# Altium schematic sheet PWR.SchDoc
size 320 x 228 mm; DocumentNumber: 4; SheetNumber: 4; SheetTotal: 5
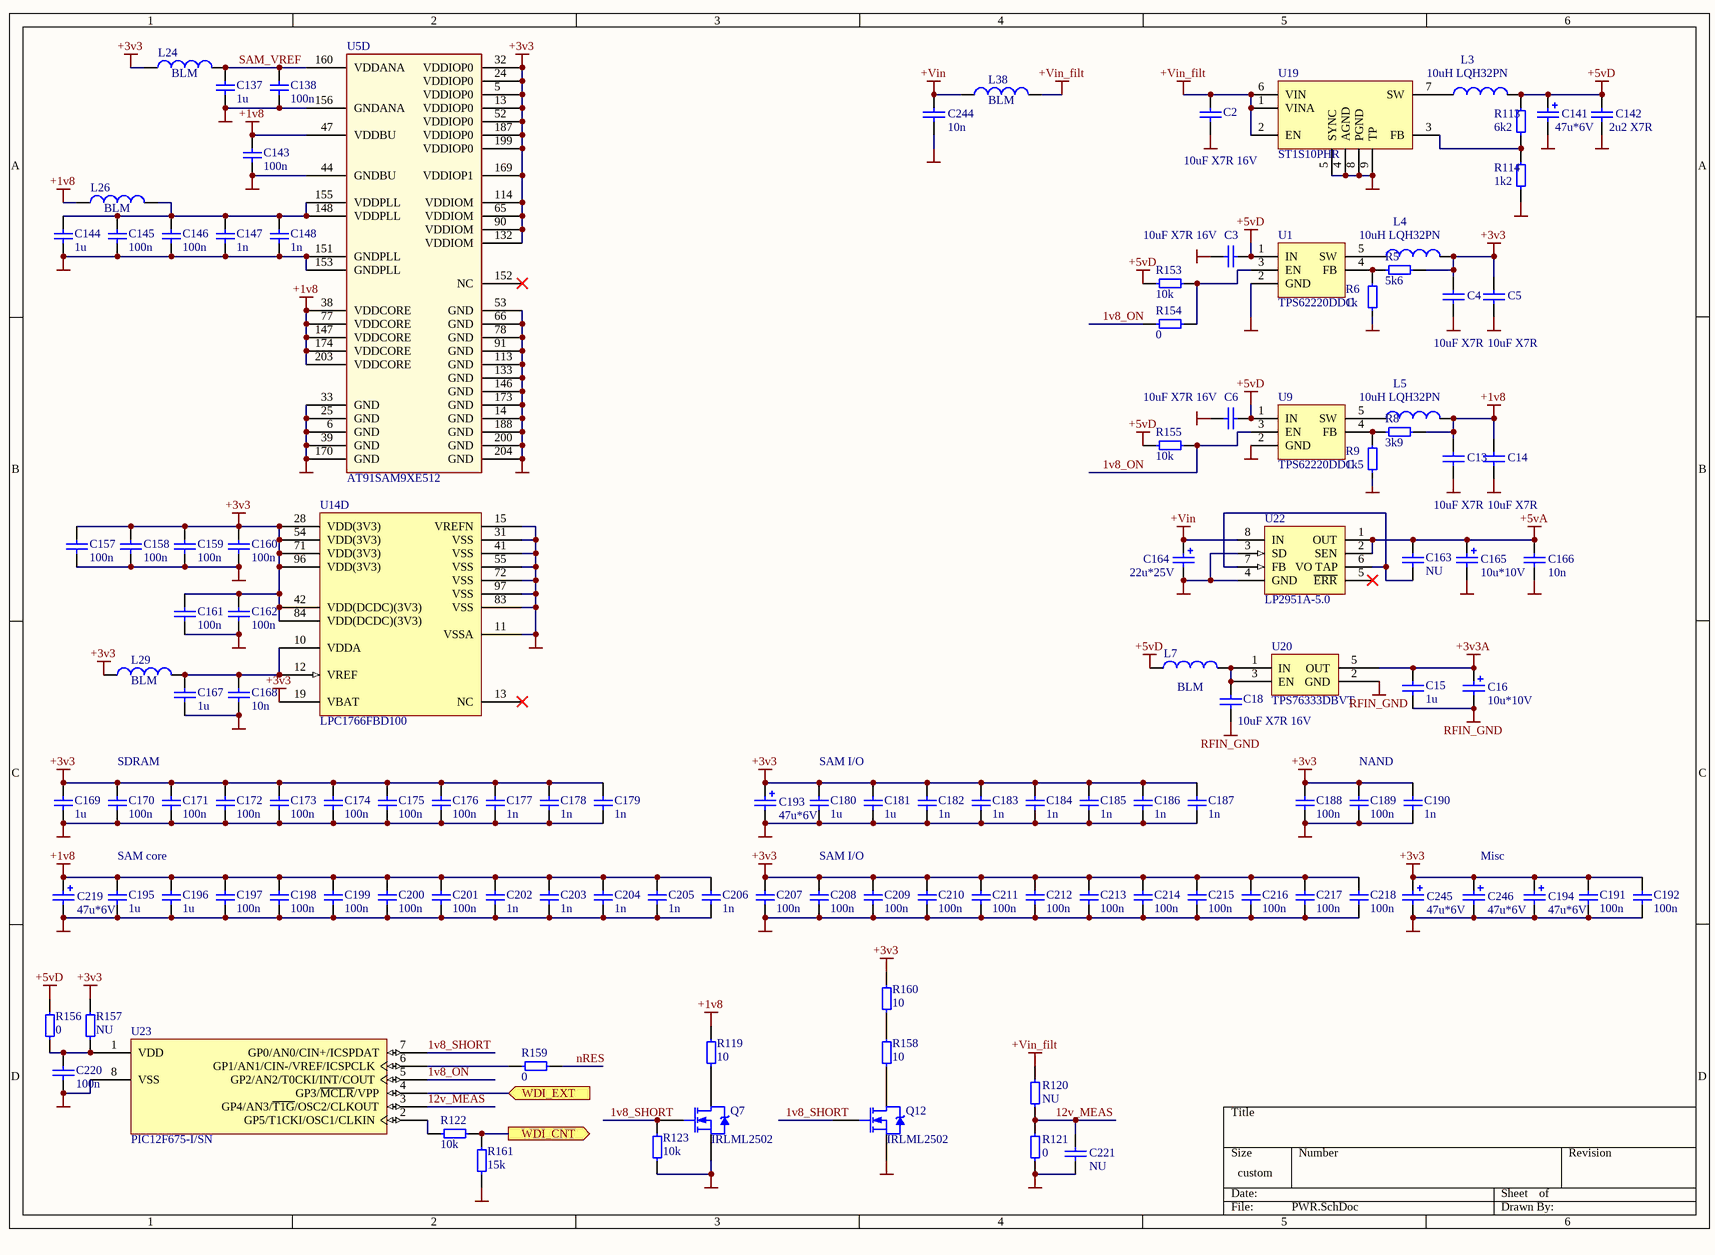
[diagram p0: PWR.SchDoc]

## Parts
C2  10uF X7R 16V  [CAPC3216M]
C3  10uF X7R 16V  [CAPC3216M]
C4  10uF X7R  [CAPC3216M]
C5  10uF X7R  [CAPC3216M]
C6  10uF X7R 16V  [CAPC3216M]
C13  10uF X7R  [CAPC3216M]
C14  10uF X7R  [CAPC3216M]
C15  1u  [CAPC2012L]
C16  10u*10V  [Case_A]
C18  10uF X7R 16V  [CAPC3216M]
C137  1u  [CAPC2012L]
C138  100n  [CAPC1608L]
C141  47u*6V  [Case_A]
C142  2u2 X7R  [CAPC2012N]
C143  100n  [CAPC1608L]
C144  1u  [CAPC2012L]
C145  100n  [CAPC1608L]
C146  100n  [CAPC1608L]
C147  1n  [CAPC1608L]
C148  1n  [CAPC1608L]
C157  100n  [CAPC1608N]
C158  100n  [CAPC1608N]
C159  100n  [CAPC1608N]
C160  100n  [CAPC1608N]
C161  100n  [CAPC1608N]
C162  100n  [CAPC1608N]
C163  NU  [CAPC1608N]
C164  22u*25V  [Case_D]
C165  10u*10V  [Case_A]
C166  10n  [CAPC1608N]
C167  1u  [CAPC2012L]
C168  10n  [CAPC1608N]
C169  1u  [CAPC2012L]
C170  100n  [CAPC1608L]
C171  100n  [CAPC1608L]
C172  100n  [CAPC1608L]
C173  100n  [CAPC1608L]
C174  100n  [CAPC1608L]
C175  100n  [CAPC1608L]
C176  100n  [CAPC1608L]
C177  1n  [CAPC1608L]
C178  1n  [CAPC1608L]
C179  1n  [CAPC1608L]
C180  1u  [CAPC2012L]
C181  1u  [CAPC2012L]
C182  1n  [CAPC1608L]
C183  1n  [CAPC1608L]
C184  1n  [CAPC1608L]
C185  1n  [CAPC1608L]
C186  1n  [CAPC1608L]
C187  1n  [CAPC1608L]
C188  100n  [CAPC1608L]
C189  100n  [CAPC1608L]
C190  1n  [CAPC1608L]
C191  100n  [CAPC1608L]
C192  100n  [CAPC1608L]
C193  47u*6V  [Case_A]
C194  47u*6V  [Case_A]
C195  1u  [CAPC2012L]
C196  1u  [CAPC2012L]
C197  100n  [CAPC1608L]
C198  100n  [CAPC1608L]
C199  100n  [CAPC1608L]
C200  100n  [CAPC1608L]
C201  100n  [CAPC1608L]
C202  1n  [CAPC1608L]
C203  1n  [CAPC1608L]
C204  1n  [CAPC1608L]
C205  1n  [CAPC1608L]
C206  1n  [CAPC1608L]
C207  100n  [CAPC1608L]
C208  100n  [CAPC1608L]
C209  100n  [CAPC1608L]
C210  100n  [CAPC1608L]
C211  100n  [CAPC1608L]
C212  100n  [CAPC1608L]
C213  100n  [CAPC1608L]
C214  100n  [CAPC1608L]
C215  100n  [CAPC1608L]
C216  100n  [CAPC1608L]
C217  100n  [CAPC1608L]
C218  100n  [CAPC1608L]
C219  47u*6V  [Case_A]
C220  100n  [CAPC1608N]
C221  NU  [CAPC1608N]
C244  10n  [CAPC1608N]
C245  47u*6V  [Case_A]
C246  47u*6V  [Case_A]
L3  10uH LQH32PN  [CAPC3225N]
L4  10uH LQH32PN  [CAPC3225N]
L5  10uH LQH32PN  [CAPC3225N]
L7  BLM  [CAPC2012N]
L24  BLM  [INDC2012L]
L26  BLM  [INDC2012L]
L29  BLM  [CAPC2012N]
L38  BLM  [CAPC2012N]
Q7  IRLML2502  [SOT-23]
Q12  IRLML2502  [SOT-23]
R5  5k6  [RESC1608L]
R6  1k  [RESC1608L]
R8  3k9  [RESC1608L]
R9  1k5  [RESC1608L]
R113  6k2  [RESC1608L]
R114  1k2  [RESC1608L]
R119  10  [RESC2012L]
R120  NU  [RESC1608L]
R121  0  [RESC1608L]
R122  10k  [RESC1608L]
R123  10k  [RESC1608L]
R153  10k  [RESC1608L]
R154  0  [RESC1608L]
R155  10k  [RESC1608L]
R156  0  [RESC1608L]
R157  NU  [RESC1608L]
R158  10  [RESC2012L]
R159  0  [RESC1608L]
R160  10  [RESC2012L]
R161  15k  [RESC1608L]
U1  TPS62220DDC  [SOT95P280X160-5L MO-193AB]
U5  AT91SAM9XE512  [SQFP50P3120X3120-208N]  (part D of 4)
U9  TPS62220DDC  [SOT95P280X160-5L MO-193AB]
U14  LPC1766FBD100  [SOT407-1_L]  (part D of 4)
U19  ST1S10PHR  [SOIC127P600X170_HS-8N]
U20  TPS76333DBVT  [SOT95P280X160-5L MO-193AB]
U22  LP2951A-5.0  [M08A_L]
U23  PIC12F675-I/SN  [SOIC-SN8_N]

## Ports
WDI_CNT (out), WDI_EXT (in)

## Nets
+1v8: C13.2 C14.2 C143.2 C195.2 C196.2 C197.2 C198.2 C199.2 C200.2 C201.2 C202.2 C203.2 C204.2 C205.2 C206.2 C219.1 L5.2 L26.1 R8.1 R119.2 U5.38(VDDCORE) U5.47(VDDBU) U5.77(VDDCORE) U5.147(VDDCORE) U5.174(VDDCORE) U5.203(VDDCORE)
+3v3: C4.2 C5.2 C157.2 C158.2 C159.2 C160.2 C161.2 C162.2 C169.2 C170.2 C171.2 C172.2 C173.2 C174.2 C175.2 C176.2 C177.2 C178.2 C179.2 C180.2 C181.2 C182.2 C183.2 C184.2 C185.2 C186.2 C187.2 C188.2 C189.2 C190.2 C191.2 C192.2 C193.1 C194.1 C207.2 C208.2 C209.2 C210.2 C211.2 C212.2 C213.2 C214.2 C215.2 C216.2 C217.2 C218.2 C245.1 C246.1 L4.2 L24.1 L29.1 R5.1 R157.2 R160.2 U5.5(VDDIOP0) U5.13(VDDIOP0) U5.24(VDDIOP0) U5.32(VDDIOP0) U5.52(VDDIOP0) U5.65(VDDIOM) U5.90(VDDIOM) U5.114(VDDIOM) U5.132(VDDIOM) U5.169(VDDIOP1) U5.187(VDDIOP0) U5.199(VDDIOP0) U14.19(VBAT) U14.28(VDD(3V3)) U14.42(VDD(DCDC)(3V3)) U14.54(VDD(3V3)) U14.71(VDD(3V3)) U14.84(VDD(DCDC)(3V3)) U14.96(VDD(3V3))
+3v3A: C15.1 C16.1 U20.5(OUT)
+5vA: C163.1 C165.1 C166.2 U22.1(OUT) U22.2(SEN)
+5vD: C3.2 C6.2 C141.1 C142.2 L3.2 L7.2 R113.2 R153.1 R155.1 R156.2 U1.1(IN) U9.1(IN)
+Vin: C164.1 C244.2 L38.1 U22.8(IN)
+Vin_filt: C2.2 L38.2 R120.2 U19.1(VINA) U19.2(EN) U19.6(VIN)
GND: C2.1 C3.1 C4.1 C5.1 C6.1 C13.1 C14.1 C137.1 C138.1 C141.2 C142.1 C143.1 C144.1 C145.1 C146.1 C147.1 C148.1 C157.1 C158.1 C159.1 C160.1 C161.1 C162.1 C164.2 C165.2 C166.1 C167.1 C168.1 C169.1 C170.1 C171.1 C172.1 C173.1 C174.1 C175.1 C176.1 C177.1 C178.1 C179.1 C180.1 C181.1 C182.1 C183.1 C184.1 C185.1 C186.1 C187.1 C188.1 C189.1 C190.1 C191.1 C192.1 C193.2 C194.2 C195.1 C196.1 C197.1 C198.1 C199.1 C200.1 C201.1 C202.1 C203.1 C204.1 C205.1 C206.1 C207.1 C208.1 C209.1 C210.1 C211.1 C212.1 C213.1 C214.1 C215.1 C216.1 C217.1 C218.1 C219.2 C220.1 C221.1 C244.1 C245.2 C246.2 Q7.2(S) Q12.2(S) R6.1 R9.1 R114.1 R121.1 R123.1 R161.1 U1.2(GND) U5.6(GND) U5.14(GND) U5.25(GND) U5.33(GND) U5.39(GND) U5.44(GNDBU) U5.53(GND) U5.66(GND) U5.78(GND) U5.91(GND) U5.113(GND) U5.133(GND) U5.146(GND) U5.151(GNDPLL) U5.153(GNDPLL) U5.156(GNDANA) U5.170(GND) U5.173(GND) U5.188(GND) U5.200(GND) U5.204(GND) U9.2(GND) U14.11(VSSA) U14.15(VREFN) U14.31(VSS) U14.41(VSS) U14.55(VSS) U14.72(VSS) U14.83(VSS) U14.97(VSS) U19.4(AGND) U19.5(SYNC) U19.8(PGND) U19.9(TP) U22.3(SD) U22.4(GND) U23.8(VSS)
RFIN_GND: C15.2 C16.2 C18.1 U20.2(GND)
1v8_ON: R154.2 R155.2 U9.3(EN) U23.5(GP2/AN2/T0CKI/INT/COUT)
1v8_SHORT: Q7.1(G) Q12.1(G) R123.2 U23.7(GP0/AN0/CIN+/ICSPDAT)
12v_MEAS: C221.2 R120.1 R121.2 U23.3(GP4/AN3/~{T1G}/OSC2/CLKOUT)
nRES: R159.1
SAM_VREF: C137.2 C138.2 L24.2 U5.160(VDDANA)
WDI_CNT: R122.2 R161.2 ; port WDI_CNT
WDI_EXT: U23.4(GP3/~{MCLR}/VPP) ; port WDI_EXT
NetC18_2: C18.2 L7.1 U20.1(IN) U20.3(EN)
NetC144_2: C144.2 C145.2 C146.2 C147.2 C148.2 L26.2 U5.148(VDDPLL) U5.155(VDDPLL)
NetC163_2: C163.2 U22.6(VO_TAP) U22.7(FB)
NetC167_2: C167.2 C168.2 L29.2 U14.10(VDDA) U14.12(VREF)
NetC220_2: C220.2 R156.1 R157.1 U23.1(VDD)
NetL3_1: L3.1 U19.7(SW)
NetL4_1: L4.1 U1.5(SW)
NetL5_1: L5.1 U9.5(SW)
NetQ7_3: Q7.3(D) R119.1
NetQ12_3: Q12.3(D) R158.1
NetR5_2: R5.2 R6.2 U1.4(FB)
NetR8_2: R8.2 R9.2 U9.4(FB)
NetR113_1: R113.1 R114.2 U19.3(FB)
NetR122_1: R122.1 U23.2(GP5/T1CKI/OSC1/CLKIN)
NetR153_2: R153.2 R154.1 U1.3(EN)
NetR158_2: R158.2 R160.1
NetR159_2: R159.2 U23.6(GP1/AN1/CIN-/VREF/ICSPCLK)

Not connected (* = marked no-connect by the designer): U5 152(NC)*; U14 13(NC)*; U22 5(~{ERR})*

## Notes on the sheet
- SDRAM
- SAM I/O
- NAND
- SAM core
- Misc

## Library data of the parts
C2-C6 C13-C15 C18 C137 C138 C142-C148 C157-C163 C166-C192 C195-C218 C220 C221 C244 = Cap: Capacitor; Value: 100pF; Published: 8-Jun-2000; LatestRevisionDate: 17-Jul-2002; LatestRevisionNote: Re-released for DXP Platform.; PackageReference: RAD-0.3; Publisher: Altium Limited
C16 C141 C164 C165 C193 C194 C219 C245 C246 = Cap Pol: Polarized Capacitor (Surface Mount); Value: 100pF; Published: 8-Jun-2000; LatestRevisionDate: 17-Jul-2002; LatestRevisionNote: Re-released for DXP Platform.; PackageReference: C0805; Publisher: Altium Limited
L3-L5 = INDUCTOR
L7 L29 L38 = Ferrite Bead: Code_IEC: 1005; Value: 10mH; Published: 8-Jun-2000; LatestRevisionDate: 17-Jul-2002; LatestRevisionNote: Re-released for DXP Platform.; PackageReference: 0402-A; Publisher: Altium Limited; Code_JEITA: 0402
L24 L26 = Inductor: Code_IEC: 1005; Value: 10mH; Published: 8-Jun-2000; LatestRevisionDate: 17-Jul-2002; LatestRevisionNote: Re-released for DXP Platform.; PackageReference: 0402-A; Publisher: Altium Limited; Code_JEITA: 0402
Q7 Q12 = IRLML2402: HEXFET Power MOSFET; Published: 8-Jun-2000; LatestRevisionDate: 17-Jul-2002; LatestRevisionNote: Re-released for DXP Platform.; DatasheetVersion: Aug-1997; PackageReference: SOT-23; Publisher: Altium Limited; PackageDescription: SOT-23; 3 Leads; Body 3.1 x 2.5 mm, inc. leads (LxW max); ComponentLink1Description: Manufacturer Link; ComponentLink1URL: http://www.irf.com/; ComponentLink2Description: Datasheet; ComponentLink2URL: http://www.irf.com/product-info/datasheets/data/irlml2402.pdf
R5 R8 R9 R113 R114 R119-R123 R153-R161 = Res: Resistor; Value: 1K; Published: 8-Jun-2000; LatestRevisionDate: 04-Mar-2005; LatestRevisionNote: PCB Footprint replaced.; PackageReference: J1-0603; Publisher: Altium Limited
R6 = Res: Resistor; Published: 8-Jun-2000; LatestRevisionDate: 04-Mar-2005; LatestRevisionNote: PCB Footprint replaced.; PackageReference: J1-0603; Publisher: Altium Limited; Value: 1K
U1 U9 = TPS6202: 1.8V 300mA SW regulator
U14 = LPC1766FBD100: ARM Cortex-M3 32-Bit Microcontroller, 512kB Flash,64kB SRAM w Ethernet,USB 2.0,Host/Device/OTG, CAN 100-Lead LQFP; Code_IEC: 136E20; Published: 17-Aug-2007; DatasheetVersion: rev.01, Jan-2007; PackageVersion: Feb-2003; PackageReference: SOT407-1; Publisher: Altium Limited; PackageDescription: 100-Pin Plastic Low Profile Quad Flat Pack, LQFP100; Code_JEDEC: MS-026; ComponentLink1Description: Manufacturer Link; ComponentLink1URL: http://www.nxp.com/; ComponentLink2Description: Datasheet; ComponentLink2URL: http://www.standardics.nxp.com/products/lpc2000/datasheet/lpc2364.lpc2366.lpc2368.pdf
U19 = ST1S10: 3 A, 900 kHz, synchronous step-down regulator
U20 = TPS76318: 1.8 V 150 mA low-dropout linear regulator
U22 = LP2951ACDMR2: MicroPower Voltage Regulator; Published: 15-Apr-2002; DatasheetVersion: Oct-1999; PackageVersion: Oct-1999; PackageReference: 846A-02; Publisher: Altium Limited; PackageDescription: Shrink Small Outline; 8 Leads; Body Width 3 mm; Pitch 0.65 mm; ComponentLink1Description: Manufacturer Link; ComponentLink1URL: http://www.onsemi.com/site/products/taxonomy/0,4438,503,00.html; ComponentLink2Description: Datasheet; ComponentLink2URL: http://www.onsemi.com/pub/Collateral/LP2950-D.PDF
U23 = PIC12F675-I/SN: FLASH-Based 8-Bit CMOS Microcontroller, 10-Bit A/D, 8-Pin SOIC 150mil, Industrial Temperature; Note: Refer to data sheet (DS41190F) for details of supply voltage range under different conditions.; FirstPublished: 11-Oct-2004; LatestRevisionDate: 02-Dec-2009; LatestRevisionNote: Updated to datasheet revision revF, Sep-2009.; DatasheetVersion: revF, Sep-2009; PackageVersion: revBB, Aug-2009; PackageReference: SOIC-SN8; Publisher: Altium Limited; PackageDescription: 8-Lead Plastic Small Outline (SN) - Narrow, 3.90mm Body [SOIC]; Supplier 1: Digi-Key; Supplier Part Number 1: PIC12F675-I/SN-ND; Supplier 2: Farnell; Supplier Part Number 2: 9759026; Supplier 3: Farnell; Supplier Part Number 3: 1660011; Supplier 4: Newark; Supplier Part Number 4: 80K7313; Code_JEDEC: MS-012; Code_IPC: SOIC127P600-8; ComponentLink1Description: Datasheet; ComponentLink1URL: http://ww1.microchip.com/downloads/en/DeviceDoc/41190F.pdf; ComponentLink2Description: Packaging Specification; ComponentLink2URL: http://www.microchip.com/stellent/groups/techpub_sg/documents/packagingspec/en012702.pdf; ComponentLink3Description: Microchip.com Home; ComponentLink3URL: http://www.microchip.com/